# EAGLE schematic STM32F103C8 v73 (EAGLE 9.7.0)
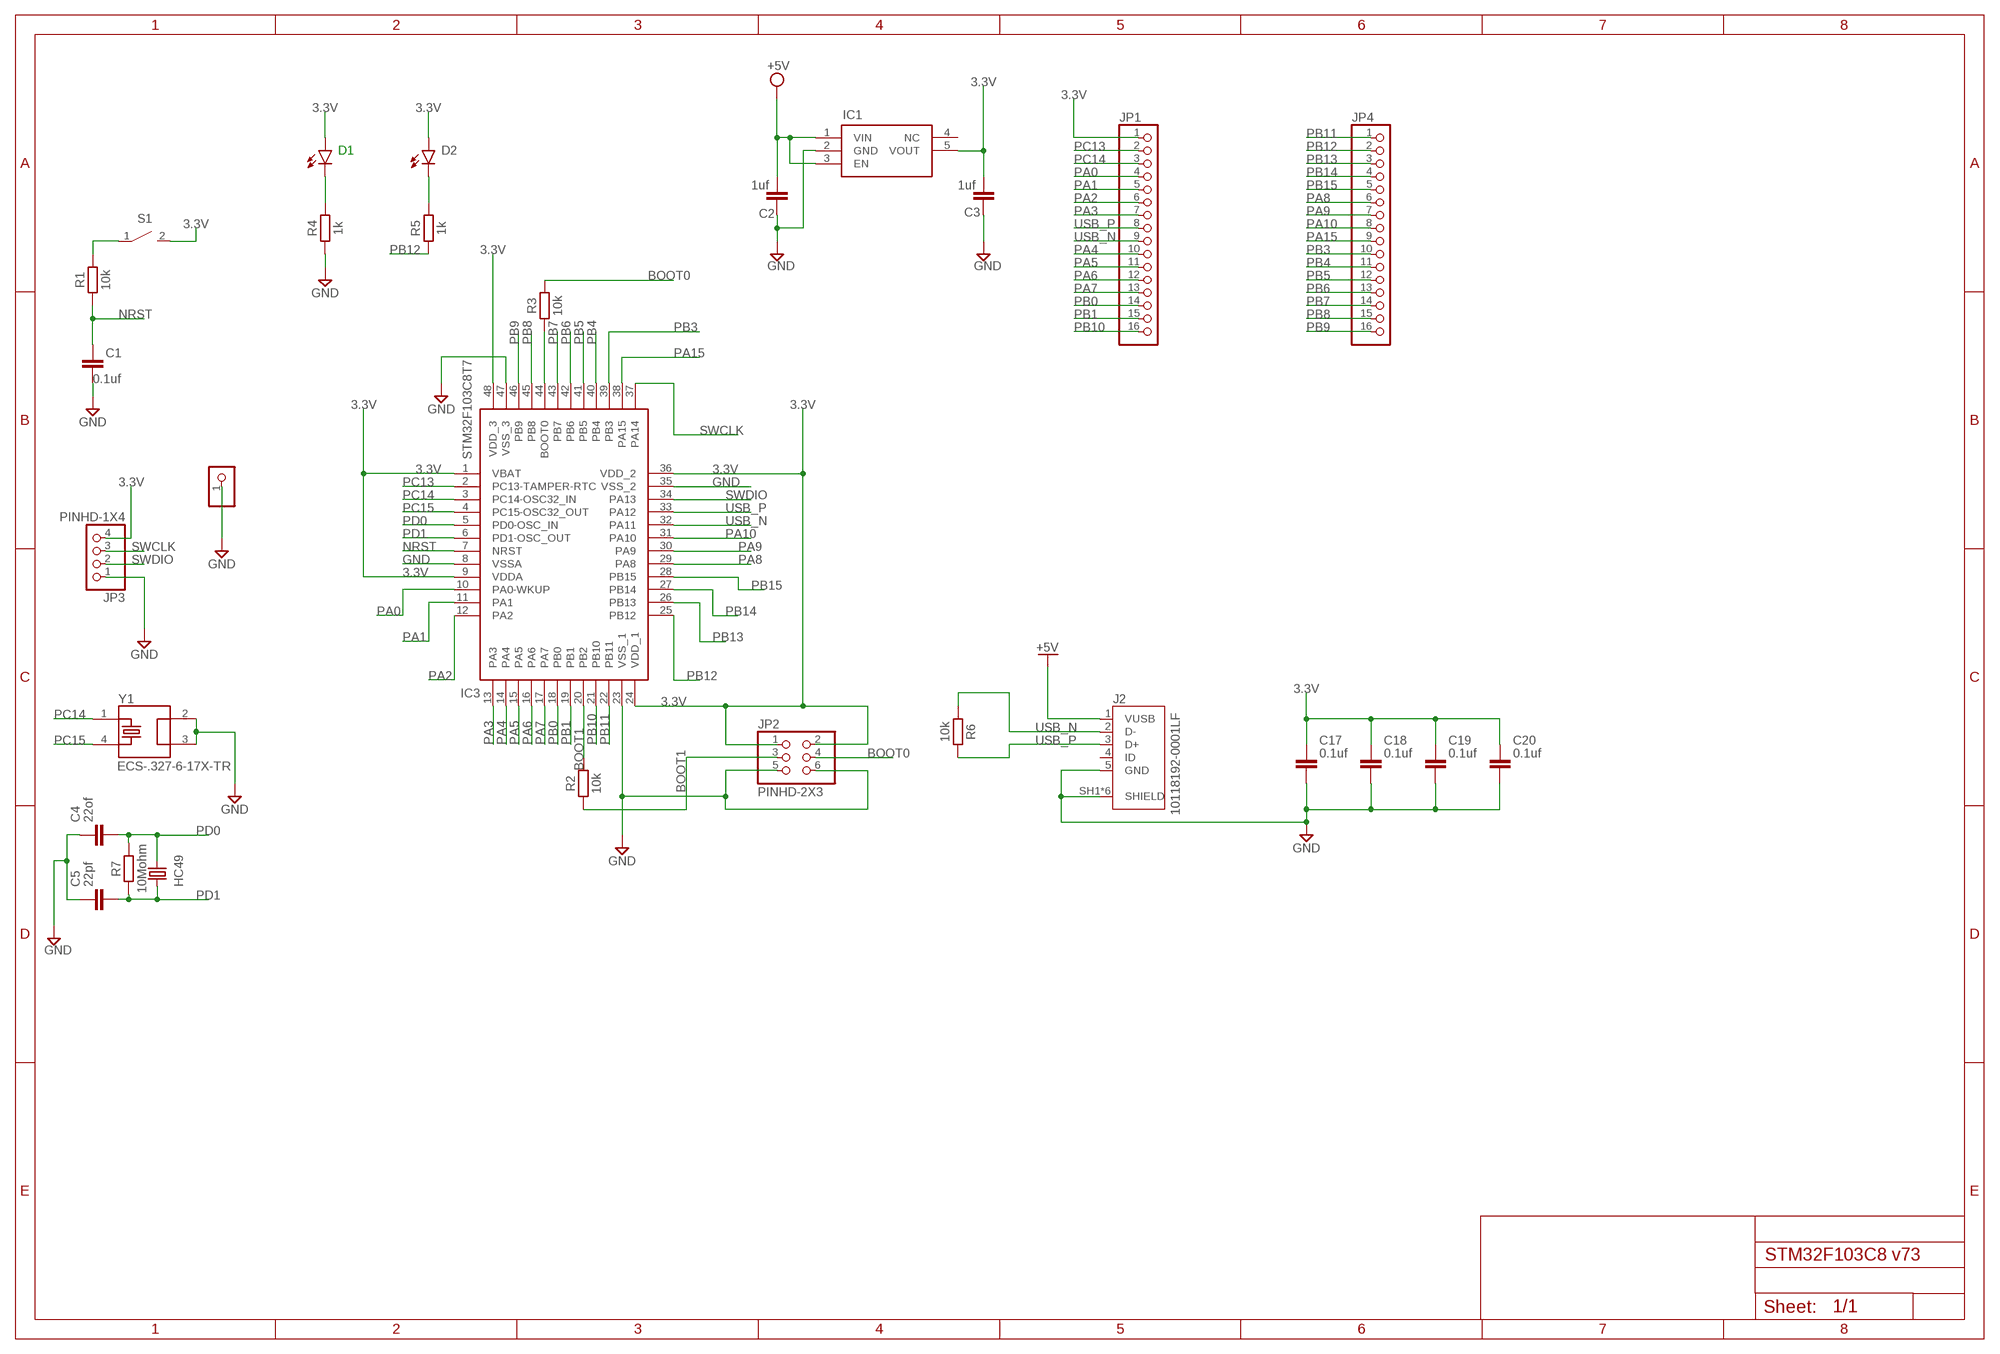
[diagram p0: schematic, sheet 1]

## Parts
C1  0.1uf  C_CHIP-0603(1608-METRIC)  [CAPC1608X85]
C2  1uf  C_CHIP-0603(1608-METRIC)  [CAPC1608X85]
C3  1uf  C_CHIP-0603(1608-METRIC)  [CAPC1608X85]
C4  22of  C_CHIP-0603(1608-METRIC)  [CAPC1608X85]
C5  22pf  C_CHIP-0603(1608-METRIC)  [CAPC1608X85]
C17  0.1uf  C_CHIP-0603(1608-METRIC)  [CAPC1608X85]
C18  0.1uf  C_CHIP-0603(1608-METRIC)  [CAPC1608X85]
C19  0.1uf  C_CHIP-0603(1608-METRIC)  [CAPC1608X85]
C20  0.1uf  C_CHIP-0603(1608-METRIC)  [CAPC1608X85]
D1  CHIP-ROUND-R_0805  [LEDC2012X105N_RND-R]
D2  Green  CHIP-ROUND-R_0805  [LEDC2012X105N_RND-R]
IC1  MIC5504-3.3YM5-TR  [SOT95P280X145-5N]
IC3  STM32F103C8T7  [QFP50P900X900X160-48N]
J2  10118192-0001LF  [AMPHENOL_10118192-0001LF]
JP1  PINHD-1X16  [1X16]
JP2  PINHD-2X3  [2X03]
JP3  PINHD-1X4  [1X04]
JP4  PINHD-1X16  [1X16]
JP5  PINHD-1X1  [1X01]
R1  10k  R_CHIP-0603(1608-METRIC)  [RESC1608X60]
R2  10k  R_CHIP-0603(1608-METRIC)  [RESC1608X60]
R3  10k  R_CHIP-0603(1608-METRIC)  [RESC1608X60]
R4  1k  R_CHIP-0603(1608-METRIC)  [RESC1608X60]
R5  1k  R_CHIP-0603(1608-METRIC)  [RESC1608X60]
R6  10k  R_CHIP-0603(1608-METRIC)  [RESC1608X60]
R7  10Mohm  R_CHIP-0603(1608-METRIC)  [RESC1608X60]
S1  B3U-1000P(M)  B3U-X000B3U-1000P(M)1000P(M)  [B3U-1000P(M)]
XTAL1  HC49  CRYSTAL_HC49-11.5L  [XTALRR488W45L1150T500H350B]
Y1  ECS-.327-6-17X-TR  [XTAL_ECS-.327-6-17X-TR]

## Nets
3.3V: C3.1 C17.1 C18.1 C19.1 C20.1 D1.A D2.A IC1.5(VOUT) IC3.1(VBAT) IC3.9(VDDA) IC3.24(VDD_1) IC3.36(VDD_2) IC3.48(VDD_3) JP1.1 JP2.1 JP2.2 JP3.4 S1.2
+5V: C2.1 IC1.1(VIN) IC1.3(EN) J2.1(VUSB)
BOOT0: JP2.4 R3.2
BOOT1: IC3.20(PB2) JP2.3 R2.1 R2.2
GND: C1.2 C2.2 C3.2 C4.1 C5.1 C17.2 C18.2 C19.2 C20.2 IC1.2(GND) IC3.8(VSSA) IC3.23(VSS_1) IC3.35(VSS_2) IC3.47(VSS_3) J2.5(GND) J2.SH1(SHIELD) J2.SH2(SHIELD) J2.SH3(SHIELD) J2.SH4(SHIELD) J2.SH5(SHIELD) J2.SH6(SHIELD) JP2.5 JP2.6 JP3.1 JP5.1 R4.1 Y1.2 Y1.3
N$1: D1.C R4.2
N$2: R1.2 S1.1
N$3: D2.C R5.2
N$10: IC3.44(BOOT0) R3.1
NRST: C1.1 IC3.7(NRST) R1.1
PA0: IC3.10(PA0-WKUP) JP1.4
PA1: IC3.11(PA1) JP1.5
PA2: IC3.12(PA2) JP1.6
PA3: IC3.13(PA3) JP1.7
PA4: IC3.14(PA4) JP1.10
PA5: IC3.15(PA5) JP1.11
PA6: IC3.16(PA6) JP1.12
PA7: IC3.17(PA7) JP1.13
PA8: IC3.29(PA8) JP4.6
PA9: IC3.30(PA9) JP4.7
PA10: IC3.31(PA10) JP4.8
PA15: IC3.38(PA15) JP4.9
PB0: IC3.18(PB0) JP1.14
PB1: IC3.19(PB1) JP1.15
PB3: IC3.39(PB3) JP4.10
PB4: IC3.40(PB4) JP4.11
PB5: IC3.41(PB5) JP4.12
PB6: IC3.42(PB6) JP4.13
PB7: IC3.43(PB7) JP4.14
PB8: IC3.45(PB8) JP4.15
PB9: IC3.46(PB9) JP4.16
PB10: IC3.21(PB10) JP1.16
PB11: IC3.22(PB11) JP4.1
PB12: IC3.25(PB12) JP4.2 R5.1
PB13: IC3.26(PB13) JP4.3
PB14: IC3.27(PB14) JP4.4
PB15: IC3.28(PB15) JP4.5
PC13: IC3.2(PC13-TAMPER-RTC) JP1.2
PC14: IC3.3(PC14-OSC32_IN) JP1.3 Y1.1
PC15: IC3.4(PC15-OSC32_OUT) Y1.4
PD0: C4.2 IC3.5(PD0-OSC_IN) R7.2 XTAL1.2
PD1: C5.2 IC3.6(PD1-OSC_OUT) R7.1 XTAL1.1
SWCLK: IC3.37(PA14) JP3.3
SWDIO: IC3.34(PA13) JP3.2
USB_N: IC3.32(PA11) J2.2(D-) JP1.9 R6.1
USB_P: IC3.33(PA12) J2.3(D+) JP1.8 R6.2
Unconnected: IC1.4(NC) J2.4(ID)

## Library data of the parts
C1-C5 C17-C20 = Capacitor:C: Capacitor - Generic; CATEGORY: Capacitor
D1 D2 = LED:CHIP-ROUND-R: LED - Generic; CATEGORY: LED; COLOR: RED; DESCRIPTION: CHIP LED ROUND; SUB-CATEGORY: CHIP; TYPE: ROUND_TOP
IC1 = MIC5504-3.3YM5-TR:MIC5504-3.3YM5-TR: MICROCHIP - MIC5504-3.3YM5-TR - LDO VOLT REG, 0.3A, 3.3V, SOT-23-5 Source: Datasheet <https://componentsearchengine.com/Datasheets/2/MIC5504-3.3YM5-TR.pdf>; ARROW_PART_NUMBER: MIC5504-3.3YM5-TR; ARROW_PRICE-STOCK: https://www.arrow.com/en/products/mic5504-3.3ym5-tr/microchip-technology; DESCRIPTION: MICROCHIP - MIC5504-3.3YM5-TR - LDO VOLT REG, 0.3A, 3.3V, SOT-23-5; HEIGHT: 1.45mm; MANUFACTURER_NAME: Microchip; MANUFACTURER_PART_NUMBER: MIC5504-3.3YM5-TR; MOUSER_PART_NUMBER: 998-MIC5504-3.3YM5TR; MOUSER_PRICE-STOCK: https://www.mouser.co.uk/ProductDetail/Microchip-Technology-Micrel/MIC5504-33YM5-TR/?qs=U6T8BxXiZAUmVQ5Zs217qQ%3D%3D
IC3 = STM32F103C8T7:STM32F103C8T7: STM32F103C8T7, 32 bit ARM Cortex M3 Microcontroller 72MHz 64 kB Flash, 20 kB RAM, USB CAN I2C 48-Pin LQFP Source: Datasheet <http://www.st.com/st-web-ui/static/active/en/resource/technical/document/datasheet/CD00161566.pdf>; ARROW_PART_NUMBER: STM32F103C8T7; ARROW_PRICE-STOCK: https://www.arrow.com/en/products/stm32f103c8t7/stmicroelectronics; DESCRIPTION: STM32F103C8T7, 32 bit ARM Cortex M3 Microcontroller 72MHz 64 kB Flash, 20 kB RAM, USB CAN I2C 48-Pin LQFP; HEIGHT: 1.6mm; MANUFACTURER_NAME: STMicroelectronics; MANUFACTURER_PART_NUMBER: STM32F103C8T7; MOUSER_PART_NUMBER: 511-STM32F103C8T7; MOUSER_PRICE-STOCK: https://www.mouser.co.uk/ProductDetail/STMicroelectronics/STM32F103C8T7/?qs=ZGWq6n3A68KjK%2FbZ7Ii58w%3D%3D
J2 = USB-micro:10118192-0001LF: Single Port 5 Contact Horizontal Right Angle Shielded Micro B USB 2.0 Connector; MANUFACTURER: Amphenol; PARTREV: B; STANDARD: Manufacturer Recommendation
JP1 JP4 = Connector:PINHD-1X16: PIN HEADER; CATEGORY: CONNECTOR; SUB-CATEGORY: PIN-HEADER
JP2 = Connector:PINHD-2X3: PIN HEADER; CATEGORY: CONNECTOR; SUB-CATEGORY: PIN-HEADER
JP3 = Connector:PINHD-1X4: PIN HEADER; CATEGORY: CONNECTOR; SUB-CATEGORY: PIN-HEADER
JP5 = Connector:PINHD-1X1: PIN HEADER; CATEGORY: CONNECTOR; SUB-CATEGORY: PIN-HEADER
R1-R7 = Resistor:R: Resistor Fixed - Generic; CATEGORY: Resistor; SUB-CATEGORY: Fixed
S1 = Switch:B3U-X000: Ultra-small Tactile Switch Contact form : SPST-NO Datasheet <https://omronfs.omron.com/en_US/ecb/products/pdf/en-b3u.pdf>; CATEGORY: SWITCH; DESCRIPTION: Ultra-small Surface-mounting Tactile Switches with High Contact Reliability; MANUFACTURER: OMRON; OPERATING_TEMPERATURE: -25°C to +70°C at 60%RH max; PART_STATUS: ACTIVE; ROHS_COMPLIANCE: RoHS Compliant; SERIES: B3U; TYPE: Tactile
XTAL1 = Frequency-Source:CRYSTAL: Crystal 2Pin - Generic; CATEGORY: Frequency-Source; SUB-CATEGORY: Crystal-2Pin
Y1 = ECS-.327-6-17X-TRT:ECS-.327-6-17X-TR: Crystal 4-SOJ, 5.50mm pitch; MANUFACTURER: ECS Inc.; PARTREV: 2016; STANDARD: Manufacturer Recommendation